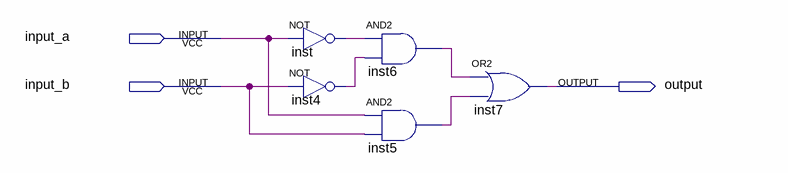
[diagram p0: schematic sheet]
// Quartus schematic 1bit_comparator.bdf as structural Verilog: 5 symbols, 3 pins
module \1bit_comparator  (
  input  input_a,
  input  input_b,
  output \output 
);

  wire inst4_out, inst5_out, inst6_out, inst_out;

  not inst (inst_out, input_a);
  not inst4 (inst4_out, input_b);
  and inst6 (inst6_out, inst_out, inst4_out);
  and inst5 (inst5_out, input_a, input_b);
  or inst7 (\output , inst6_out, inst5_out);
endmodule
